# EAGLE design LogicSniffer-v1rev4-batchpcb (EAGLE 5.06)
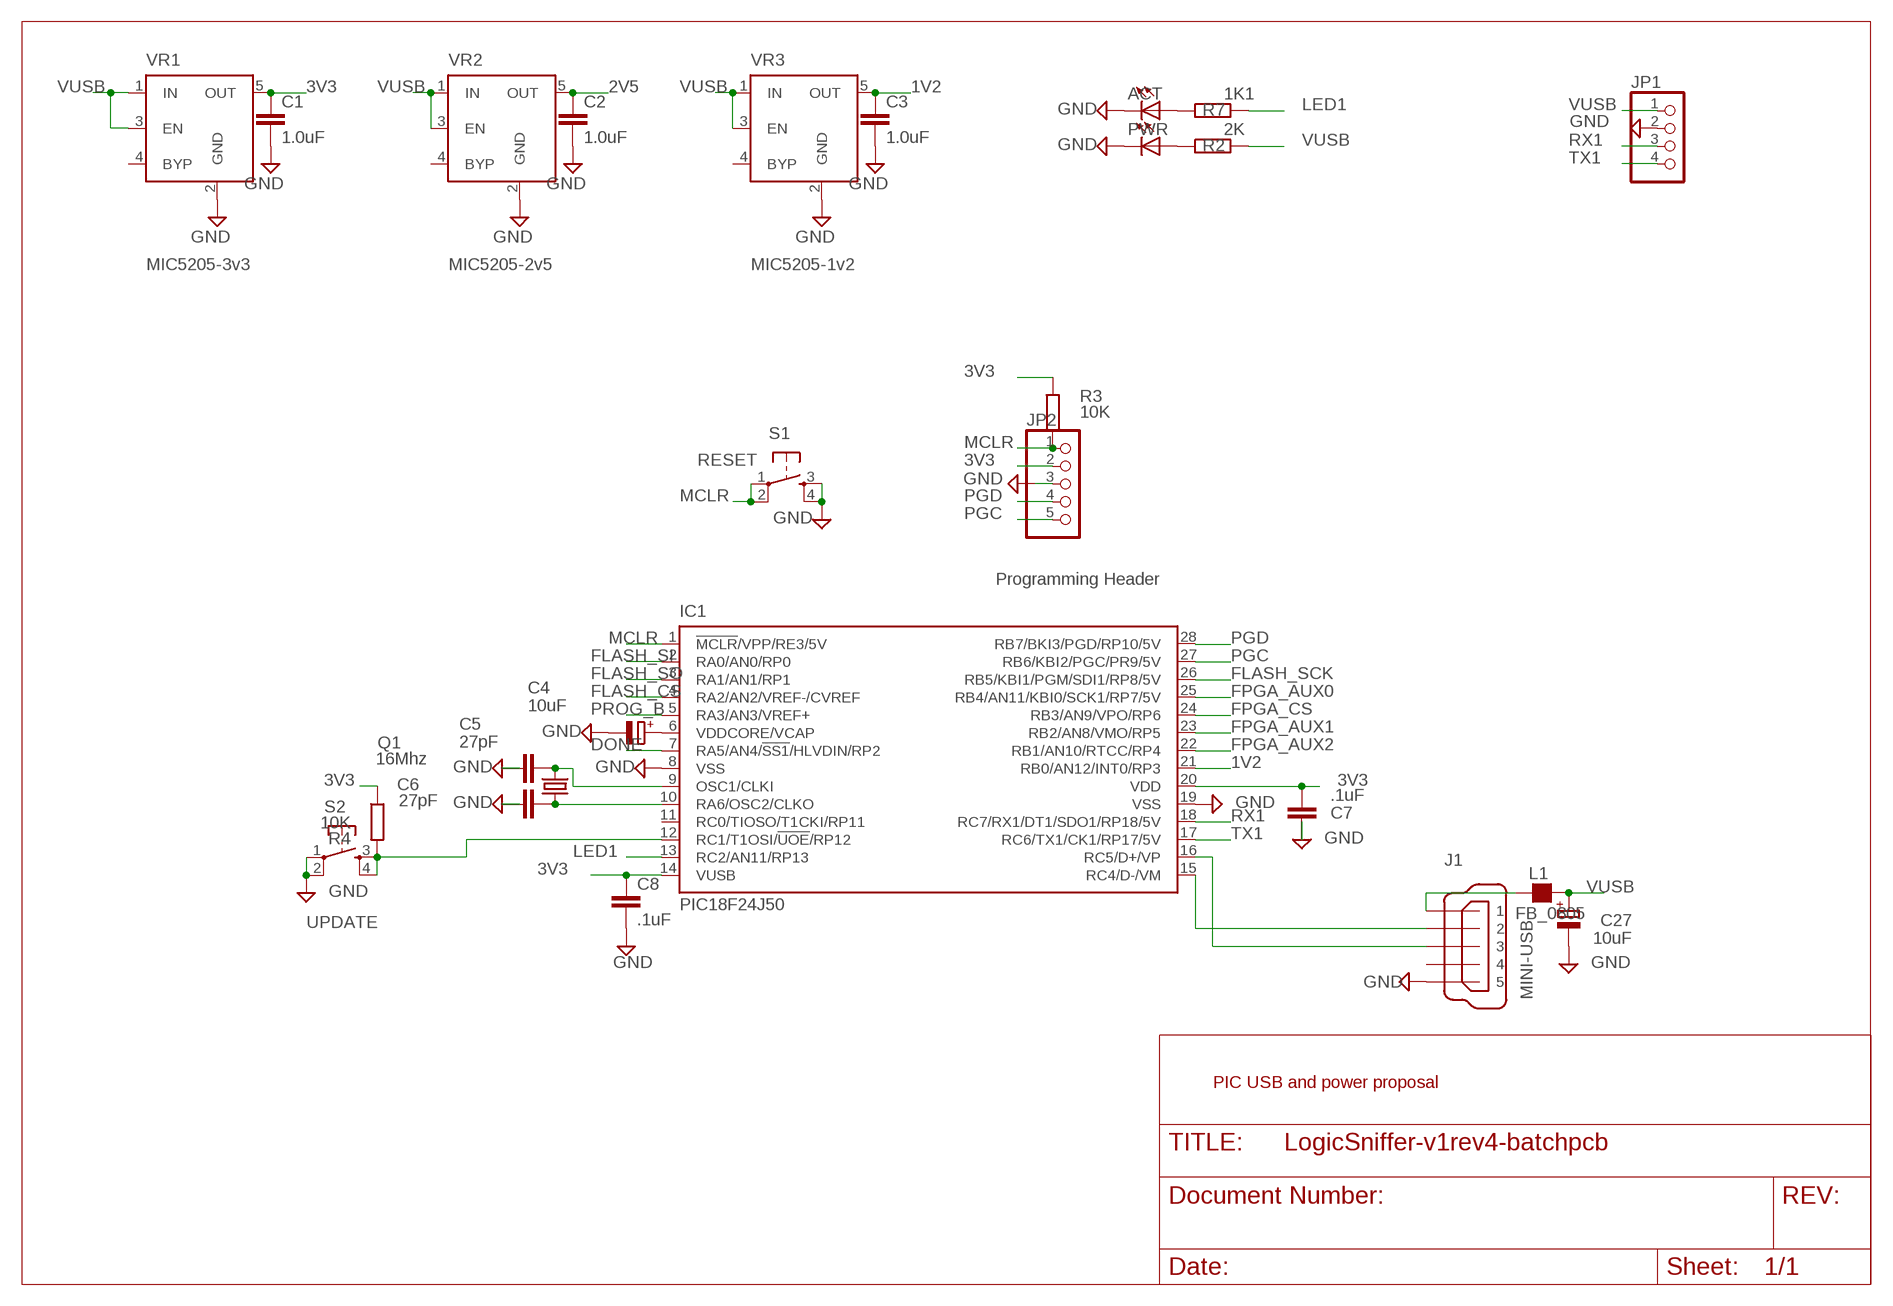
[diagram p0: schematic, sheet 1, part 1 of 2]
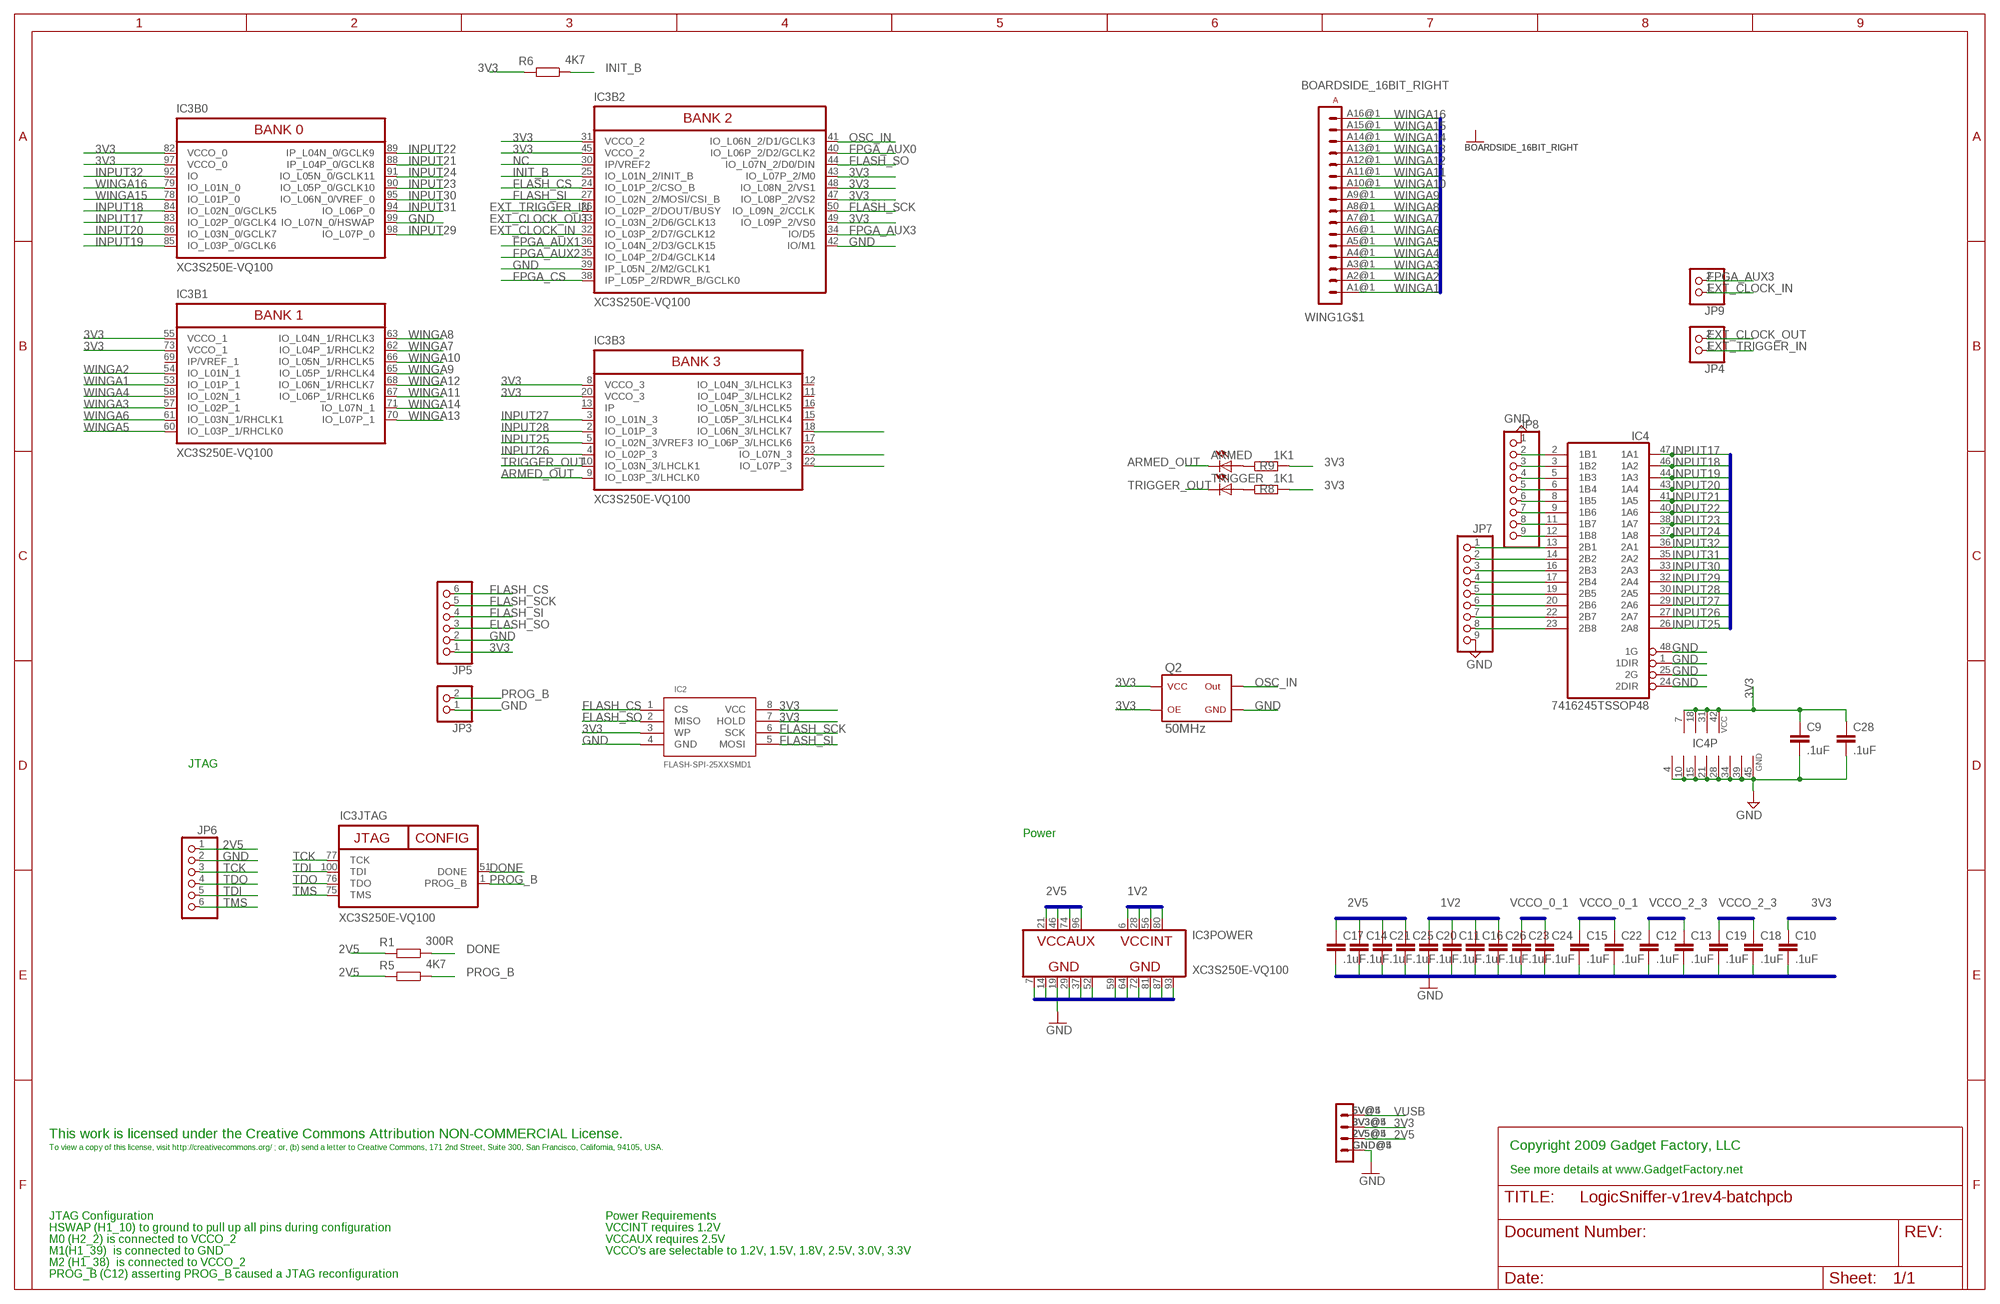
[diagram p1: schematic, sheet 1, part 2 of 2]

## Parts
ACT  LEDCHIP-LED0805  [CHIP-LED0805]
ARMED  LEDCHIP-LED0805  [CHIP-LED0805]
C1  1.0uF  C-EUC0805  [C0805]
C2  1.0uF  C-EUC0805  [C0805]
C3  1.0uF  C-EUC0805  [C0805]
C4  10uF  CPOL-EUSMCA  [SMC_A]
C5  27pF  C-EUC0805  [C0805]
C6  27pF  C-EUC0805  [C0805]
C7  .1uF  C-EUC0603  [C0603]
C8  .1uF  C-EUC0603  [C0603]
C9  .1uF  C-EUC0603K  [C0603K]
C10  .1uF  C-EUC0603K  [C0603K]
C11  .1uF  C-EUC0603K  [C0603K]
C12  .1uF  C-EUC0603K  [C0603K]
C13  .1uF  C-EUC0603K  [C0603K]
C14  .1uF  C-EUC0603K  [C0603K]
C15  .1uF  C-EUC0603K  [C0603K]
C16  .1uF  C-EUC0603K  [C0603K]
C17  .1uF  C-EUC0603K  [C0603K]
C18  .1uF  C-EUC0603K  [C0603K]
C19  .1uF  C-EUC0603K  [C0603K]
C20  .1uF  C-EUC0603K  [C0603K]
C21  .1uF  C-EUC0603K  [C0603K]
C22  .1uF  C-EUC0603K  [C0603K]
C23  .1uF  C-EUC0603K  [C0603K]
C24  .1uF  C-EUC0603K  [C0603K]
C25  .1uF  C-EUC0603K  [C0603K]
C26  .1uF  C-EUC0603  [C0603]
C27  10uF  CPOL-EUSMCA  [SMC_A]
C28  .1uF  C-EUC0603K  [C0603K]
IC1  PIC18F24J50  MICROCHIPSSOP  [SSOP28]
IC2  FLASH-SPI-25XXSMD1  [SO08-EIAJ]
IC3  XC3S250E-VQ100  [VQ100]
IC4  7416245TSSOP48  [TSSOP48]
J1  MINI-USB  MINI-USB-32005-201  [32005-201]
JP1  PINHD-1X4  [1X04]
JP2  PINHD-1X5  [1X05]
JP3  PINHD-1X2  [1X02]
JP4  PINHD-1X2  [1X02]
JP5  PINHD-1X6  [1X06]
JP6  PINHD-1X6  [1X06]
JP7  PINHD-1X9  [1X09]
JP8  PINHD-1X9  [1X09]
JP9  PINHD-1X2  [1X02]
L1  FB_0805  [L0805]
PWR  LEDCHIP-LED0805  [CHIP-LED0805]
Q1  16Mhz  CRYSTALHC49UP  [HC49UP]
Q2  50MHz  OSC1  [OSC1]
R1  300R  R-EU_R0805  [R0805]
R2  2K  R-EU_M0805  [M0805]
R3  10K  R-EU_R0805  [R0805]
R4  10K  R-EU_R0805  [R0805]
R5  4K7  R-EU_R0805  [R0805]
R6  4K7  R-EU_R0805  [R0805]
R7  1K1  R-EU_M0805  [M0805]
R8  1K1  R-EU_M0805  [M0805]
R9  1K1  R-EU_M0805  [M0805]
S1  RESET  TAC_SWITCHSND  [TACTILE_SWITCH_SMD]
S2  UPDATE  TAC_SWITCHSND  [TACTILE_SWITCH_SMD]
TRIGGER  LEDCHIP-LED0805  [CHIP-LED0805]
VR1  MIC5205-3v3  MIC5219XX  [SOT23-5]
VR2  MIC5205-2v5  MIC5219XX  [SOT23-5]
VR3  MIC5205-1v2  MIC5219XX  [SOT23-5]
WING1  BOARDSIDE_16BIT_RIGHT  [BOARDSIDE_16BIT_RIGHT]

## Nets
1V2: C3.1 C11.1 C16.1 C20.1 C26.1 IC1.21(RB0/AN12/INT0/RP3) IC3.6(POWER:VCCINT) IC3.28(POWER:VCCINT) IC3.56(POWER:VCCINT) IC3.80(POWER:VCCINT) VR3.5(OUT)
2V5: C2.1 C14.1 C17.1 C21.1 C25.1 IC3.21(POWER:VCCAUX) IC3.46(POWER:VCCAUX) IC3.74(POWER:VCCAUX) IC3.96(POWER:VCCAUX) JP6.1 R1.2 R5.2 VR2.5(OUT) WING1.2V5@4(2V5) WING1.2V5@5(2V5)
3V3: C1.1 C7.1 C8.1 C9.1 C10.1 C12.1 C13.1 C15.1 C18.1 C19.1 C22.1 C23.1 C24.1 C28.1 IC1.14(VUSB) IC1.20(VDD) IC2.3(WP) IC2.7(HOLD) IC2.8(VCC) IC3.8(B3:VCCO_3) IC3.20(B3:VCCO_3) IC3.31(B2:VCCO_2) IC3.43(B2:IO_L07P_2/M0) IC3.45(B2:VCCO_2) IC3.47(B2:IO_L08P_2/VS2) IC3.48(B2:IO_L08N_2/VS1) IC3.49(B2:IO_L09P_2/VS0) IC3.55(B1:VCCO_1) IC3.73(B1:VCCO_1) IC3.82(B0:VCCO_0) IC3.97(B0:VCCO_0) IC4.7(VCC) IC4.18(VCC) IC4.31(VCC) IC4.42(VCC) JP2.2 JP5.1 Q2.1@1(OE) Q2.4@4(VCC) R3.2 R4.1 R6.2 R8.2 R9.2 VR1.5(OUT) WING1.3V3@4(3V3) WING1.3V3@5(3V3)
$N23: J1.1 L1.1
ARMED_OUT: ARMED.C IC3.9(B3:IO_L03P_3/LHCLK0)
DONE: IC1.7(RA5/AN4/!SS1!/HLVDIN/RP2) IC3.51(JTAG:DONE) R1.1
EXT_CLOCK_IN: IC3.32(B2:IO_L03P_2/D7/GCLK12) JP9.1
EXT_CLOCK_OUT: IC3.33(B2:IO_L03N_2/D6/GCLK13) JP4.2
EXT_TRIGGER_IN: IC3.26(B2:IO_L02P_2/DOUT/BUSY) JP4.1
FLASH_CS: IC1.4(RA2/AN2/VREF-/CVREF) IC2.1(CS) IC3.24(B2:IO_L01P_2/CSO_B) JP5.6
FLASH_SCK: IC1.26(RB5/KBI1/PGM/SDI1/RP8/5V) IC2.6(SCK) IC3.50(B2:IO_L09N_2/CCLK) JP5.5
FLASH_SI: IC1.2(RA0/AN0/RP0) IC2.5(MOSI) IC3.27(B2:IO_L02N_2/MOSI/CSI_B) JP5.4
FLASH_SO: IC1.3(RA1/AN1/RP1) IC2.2(MISO) IC3.44(B2:IO_L07N_2/D0/DIN) JP5.3
FPGA_AUX0: IC1.25(RB4/AN11/KBI0/SCK1/RP7/5V) IC3.40(B2:IO_L06P_2/D2/GCLK2)
FPGA_AUX1: IC1.23(RB2/AN8/VMO/RP5) IC3.36(B2:IO_L04N_2/D3/GCLK15)
FPGA_AUX2: IC1.22(RB1/AN10/RTCC/RP4) IC3.35(B2:IO_L04P_2/D4/GCLK14)
FPGA_AUX3: IC3.34(B2:IO/D5) JP9.2
FPGA_CS: IC1.24(RB3/AN9/VPO/RP6) IC3.38(B2:IP_L05P_2/RDWR_B/GCLK0)
GND: ACT.C C1.2 C2.2 C3.2 C4.- C5.2 C6.2 C7.2 C8.2 C9.2 C10.2 C11.2 C12.2 C13.2 C14.2 C15.2 C16.2 C17.2 C18.2 C19.2 C20.2 C21.2 C22.2 C23.2 C24.2 C25.2 C26.2 C27.- C28.2 IC1.8(VSS) IC1.19(VSS) IC2.4(GND) IC3.7(POWER:GND) IC3.14(POWER:GND) IC3.19(POWER:GND) IC3.29(POWER:GND) IC3.37(POWER:GND) IC3.39(B2:IP_L05N_2/M2/GCLK1) IC3.42(B2:IO/M1) IC3.52(POWER:GND) IC3.59(POWER:GND) IC3.64(POWER:GND) IC3.72(POWER:GND) IC3.81(POWER:GND) IC3.87(POWER:GND) IC3.93(POWER:GND) IC3.99(B0:IO_L07N_0/HSWAP) IC4.1(1DIR) IC4.4(GND) IC4.10(GND) IC4.15(GND) IC4.21(GND) IC4.24(2DIR) IC4.25(2G) IC4.28(GND) IC4.34(GND) IC4.39(GND) IC4.45(GND) IC4.48(1G) J1.5 JP1.2 JP2.3 JP3.1 JP5.2 JP6.2 JP7.9 JP8.1 PWR.C Q2.2@2(GND) S1.3 S1.4 S2.1 S2.2 VR1.2(GND) VR2.2(GND) VR3.2(GND) WING1.GND@1(GND) WING1.GND@2(GND) WING1.GND@4(GND) WING1.GND@5(GND)
INIT_B: IC3.25(B2:IO_L01N_2/INIT_B) R6.1
INPUT17: IC3.83(B0:IO_L02P_0/GCLK4) IC4.47(1A1)
INPUT18: IC3.84(B0:IO_L02N_0/GCLK5) IC4.46(1A2)
INPUT19: IC3.85(B0:IO_L03P_0/GCLK6) IC4.44(1A3)
INPUT20: IC3.86(B0:IO_L03N_0/GCLK7) IC4.43(1A4)
INPUT21: IC3.88(B0:IP_L04P_0/GCLK8) IC4.41(1A5)
INPUT22: IC3.89(B0:IP_L04N_0/GCLK9) IC4.40(1A6)
INPUT23: IC3.90(B0:IO_L05P_0/GCLK10) IC4.38(1A7)
INPUT24: IC3.91(B0:IO_L05N_0/GCLK11) IC4.37(1A8)
INPUT25: IC3.5(B3:IO_L02N_3/VREF3) IC4.26(2A8)
INPUT26: IC3.4(B3:IO_L02P_3) IC4.27(2A7)
INPUT27: IC3.3(B3:IO_L01N_3) IC4.29(2A6)
INPUT28: IC3.2(B3:IO_L01P_3) IC4.30(2A5)
INPUT29: IC3.98(B0:IO_L07P_0) IC4.32(2A4)
INPUT30: IC3.95(B0:IO_L06N_0/VREF_0) IC4.33(2A3)
INPUT31: IC3.94(B0:IO_L06P_0) IC4.35(2A2)
INPUT32: IC3.92(B0:IO) IC4.36(2A1)
LED1: IC1.13(RC2/AN11/RP13) R7.2
MCLR: IC1.1(!MCLR!/VPP/RE3/5V) JP2.1 R3.1 S1.1 S1.2
N$1: C5.1 IC1.9(OSC1/CLKI) Q1.2
N$2: C6.1 IC1.10(RA6/OSC2/CLKO) Q1.1
N$3: IC1.12(RC1/T1OSI/!UOE!/RP12) R4.2 S2.3 S2.4
N$4: C4.+ IC1.6(VDDCORE/VCAP)
N$5: PWR.A R2.1
N$6: ARMED.A R9.1
N$7: ACT.A R7.1
N$8: R8.1 TRIGGER.A
N$9: IC3.22(B3:IO_L07P_3)
N$10: IC3.23(B3:IO_L07N_3)
N$11: IC4.12(1B8) JP8.9
N$12: IC4.11(1B7) JP8.8
N$13: IC4.9(1B6) JP8.7
N$14: IC4.8(1B5) JP8.6
N$15: IC4.6(1B4) JP8.5
N$16: IC4.5(1B3) JP8.4
N$17: IC4.3(1B2) JP8.3
N$18: IC4.2(1B1) JP8.2
N$19: IC4.13(2B1) JP7.1
N$20: IC4.14(2B2) JP7.2
N$21: IC3.18(B3:IO_L06N_3/LHCLK7)
N$22: IC4.16(2B3) JP7.3
N$23: IC4.17(2B4) JP7.4
N$24: IC4.19(2B5) JP7.5
N$25: IC4.20(2B6) JP7.6
N$26: IC4.22(2B7) JP7.7
N$27: IC4.23(2B8) JP7.8
NC: IC3.30(B2:IP/VREF2)
OSC_IN: IC3.41(B2:IO_L06N_2/D1/GCLK3) Q2.3@3(OUT)
PGC: IC1.27(RB6/KBI2/PGC/PR9/5V) JP2.5
PGD: IC1.28(RB7/BKI3/PGD/RP10/5V) JP2.4
PROG_B: IC1.5(RA3/AN3/VREF+) IC3.1(JTAG:PROG_B) JP3.2 R5.1
RC4: IC1.15(RC4/D-/VM) J1.2
RC5: IC1.16(RC5/D+/VP) J1.3
RX1: IC1.18(RC7/RX1/DT1/SDO1/RP18/5V) JP1.3
TCK: IC3.77(JTAG:TCK) JP6.3
TDI: IC3.100(JTAG:TDI) JP6.5
TDO: IC3.76(JTAG:TDO) JP6.4
TMS: IC3.75(JTAG:TMS) JP6.6
TRIGGER_OUT: IC3.10(B3:IO_L03N_3/LHCLK1) TRIGGER.C
TX1: IC1.17(RC6/TX1/CK1/RP17/5V) JP1.4
VUSB: C27.+ JP1.1 L1.2 R2.2 VR1.1(IN) VR1.3(EN) VR2.1(IN) VR2.3(EN) VR3.1(IN) VR3.3(EN) WING1.5V@4(5V) WING1.5V@5(5V)
WINGA1: IC3.53(B1:IO_L01P_1) WING1.A1@1(A1)
WINGA2: IC3.54(B1:IO_L01N_1) WING1.A2@1(A2)
WINGA3: IC3.57(B1:IO_L02P_1) WING1.A3@1(A3)
WINGA4: IC3.58(B1:IO_L02N_1) WING1.A4@1(A4)
WINGA5: IC3.60(B1:IO_L03P_1/RHCLK0) WING1.A5@1(A5)
WINGA6: IC3.61(B1:IO_L03N_1/RHCLK1) WING1.A6@1(A6)
WINGA7: IC3.62(B1:IO_L04P_1/RHCLK2) WING1.A7@1(A7)
WINGA8: IC3.63(B1:IO_L04N_1/RHCLK3) WING1.A8@1(A8)
WINGA9: IC3.65(B1:IO_L05P_1/RHCLK4) WING1.A9@1(A9)
WINGA10: IC3.66(B1:IO_L05N_1/RHCLK5) WING1.A10@1(A10)
WINGA11: IC3.67(B1:IO_L06P_1/RHCLK6) WING1.A11@1(A11)
WINGA12: IC3.68(B1:IO_L06N_1/RHCLK7) WING1.A12@1(A12)
WINGA13: IC3.70(B1:IO_L07P_1) WING1.A13@1(A13)
WINGA14: IC3.71(B1:IO_L07N_1) WING1.A14@1(A14)
WINGA15: IC3.78(B0:IO_L01P_0) WING1.A15@1(A15)
WINGA16: IC3.79(B0:IO_L01N_0) WING1.A16@1(A16)
Unconnected: IC1.11(RC0/TIOSO/T1CKI/RP11) IC3.11(B3:IO_L04P_3/LHCLK2) IC3.12(B3:IO_L04N_3/LHCLK3) IC3.13(B3:IP) IC3.15(B3:IO_L05P_3/LHCLK4) IC3.16(B3:IO_L05N_3/LHCLK5) IC3.17(B3:IO_L06P_3/LHCLK6) IC3.69(B1:IP/VREF_1) J1.4 VR1.4(BYP) VR2.4(BYP) VR3.4(BYP)

## Buses
GND
2V5
1V2
VCCO_0_1
VCCO_2_3
3V3
WINGA[1..16]
INPUT[17..32]

## Notes on the sheet
- RESET
- Programming Header
- JTAG
- UPDATE
- Power
- PIC USB and power proposal
- This work is licensed under the Creative Commons Attribution NON-COMMERCIAL License.
- To view a copy of this license, visit http://creativecommons.org/ ; or, (b) send a letter to Creative Commons, 171 2nd Street, Suite 300, San Francisco, California, 94105, USA. | Copyright 2009 Gadget Factory, LLC
- See more details at www.GadgetFactory.net
- JTAG Configuration | Power Requirements
- HSWAP (H1_10) to ground to pull up all pins during configuration | VCCINT requires 1.2V
- M0 (H2_2) is connected to VCCO_2 | VCCAUX requires 2.5V
- M1(H1_39)  is connected to GND | VCCO's are selectable to 1.2V, 1.5V, 1.8V, 2.5V, 3.0V, 3.3V
- M2 (H1_38)  is connected to VCCO_2
- PROG_B (C12) asserting PROG_B caused a JTAG reconfiguration

## Library data of the parts
ACT ARMED PWR TRIGGER = led:LED: LED OSRAM: - CHIPLED LG R971, LG N971, LY N971, LG Q971, LY Q971, LO R971, LY R971 LH N974, LH R974 LS Q976, LO Q976, LY Q976 LO Q996 - Hyper CHIPLED LW Q18S LB Q993, LB Q99A, LB R99A - SideLED LS A670, LO A670, LY A670, LG A670, LP A670 LB A673, LV A673, LT A673, LW A673 LH A674 LY A675 LS A676, LA A676, LO A676, LY A676, LW A676 LS A679, LY A679, LG A679 - Hyper Micro SIDELED® LS Y876, LA Y876, LO Y876, LY Y876 LT Y87S - SmartLED LW L88C, LW L88S LB L89C, LB L89S, LG L890 LS L89K, LO L89K, LY L89K LS L896, LA L896, LO L896, LY L896 - TOPLED LS T670, LO T670, LY T670, LG T670, LP T670 LSG T670, LSP T670, LSY T670, LOP T670, LYG T670 LG T671, LOG T671, LSG T671 LB T673, LV T673, LT T673, LW T673 LH T674 LS T676, LA T676, LO T676, LY T676, LB T676, LH T676, LSB T676, LW T676 LB T67C, LV T67C, LT T67C, LS T67K, LO T67K, LY T67K, LW E67C LS E67B, LA E67B, LO E67B, LY E67B, LB E67C, LV E67C, LT E67C LW T67C LS T679, LY T679, LG T679 LS T770, LO T770, LY T770, LG T770, LP T770 LB T773, LV T773, LT T773, LW T773 LH T774 LS E675, LA E675, LY E675, LS T675 LS T776, LA T776, LO T776, LY T776, LB T776 LHGB T686 LT T68C, LB T68C - Hyper Mini TOPLED® LB M676 - Mini TOPLED Santana® LG M470 LS M47K, LO M47K, LY M47K Source: http://www.osram.convergy.de - LUMILED® LXK2-PW12-R00, LXK2-PW12-S00, LXK2-PW14-U00, LXK2-PW14-V00 LXK2-PM12-R00, LXK2-PM12-S00, LXK2-PM14-U00 LXK2-PE12-Q00, LXK2-PE12-R00, LXK2-PE12-S00, LXK2-PE14-T00, LXK2-PE14-U00 LXK2-PB12-K00, LXK2-PB12-L00, LXK2-PB12-M00, LXK2-PB14-N00, LXK2-PB14-P00, LXK2-PB14-Q00 LXK2-PR12-L00, LXK2-PR12-M00, LXK2-PR14-Q00, LXK2-PR14-R00 LXK2-PD12-Q00, LXK2-PD12-R00, LXK2-PD12-S00 LXK2-PH12-R00, LXK2-PH12-S00 LXK2-PL12-P00, LXK2-PL12-Q00, LXK2-PL12-R00 Source: www.luxeon.com
C1-C3 C5-C26 C28 = rcl:C-EU: CAPACITOR, European symbol
C4 C27 = rcl:CPOL-EU: POLARIZED CAPACITOR, European symbol
IC1 = library3:MICROCHIP
IC2 = GadgetFactory:FLASH-SPI-25XX: SPI Flash
IC3 = xilinx-xc3sxxxe_vq100:XC3S250E: Xilinx Spartan 3E FPGA
IC4 = dp_devices:74*16245: 16-bit BUS TRANSCEIVER, 3-state
J1 = con-cypressindustries:MINI-USB-: MINI USB-B Conector Source: www.cypressindustries.com
JP1 = pinhead-2:PINHD-1X4: PIN HEADER
JP2 = pinhead-2:PINHD-1X5: PIN HEADER
JP3 JP4 JP9 = pinhead-2:PINHD-1X2: PIN HEADER
JP5 JP6 = pinhead-2:PINHD-1X6: PIN HEADER
JP7 JP8 = pinhead-2:PINHD-1X9: PIN HEADER
L1 = rc-master-smd:FB_: FERRITE BEAD
Q1 = crystal:CRYSTAL: CRYSTAL
Q2 = MondoCPLDCore-XC95_Rev1.5:OSC1
R1-R9 = rcl:R-EU_: RESISTOR, European symbol
S1 S2 = SparkFun-3-2-07:TAC_SWITCH: Momentary Switch Button commonly used for reset or general input. Spark Fun Electronics SKU : Comp-PBS
VR1-VR3 = v-reg-micrel:MIC5219XX: VOLTAGE REGULATOR
WING1 = GadgetFactory:BOARDSIDE_16BIT_RIGHT

## Board
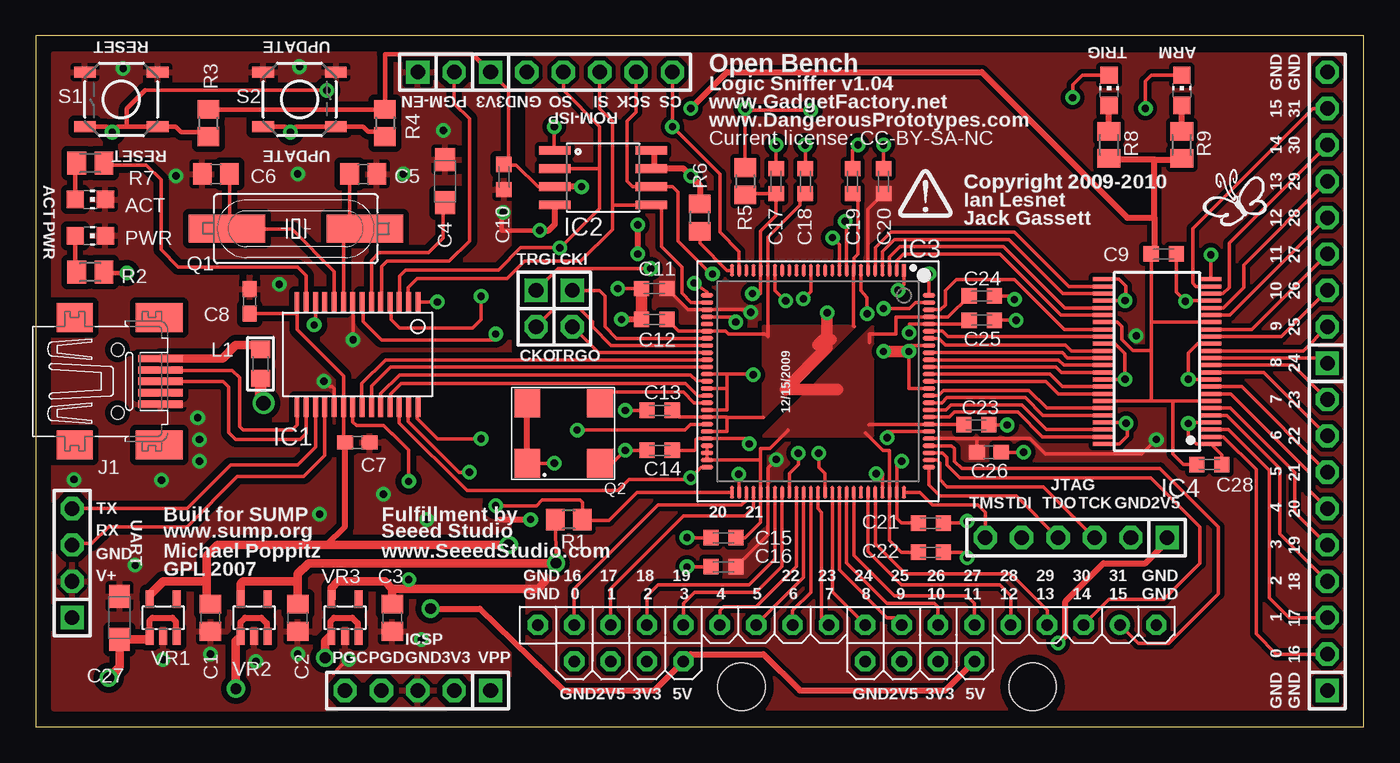
[diagram p2: board, top side]
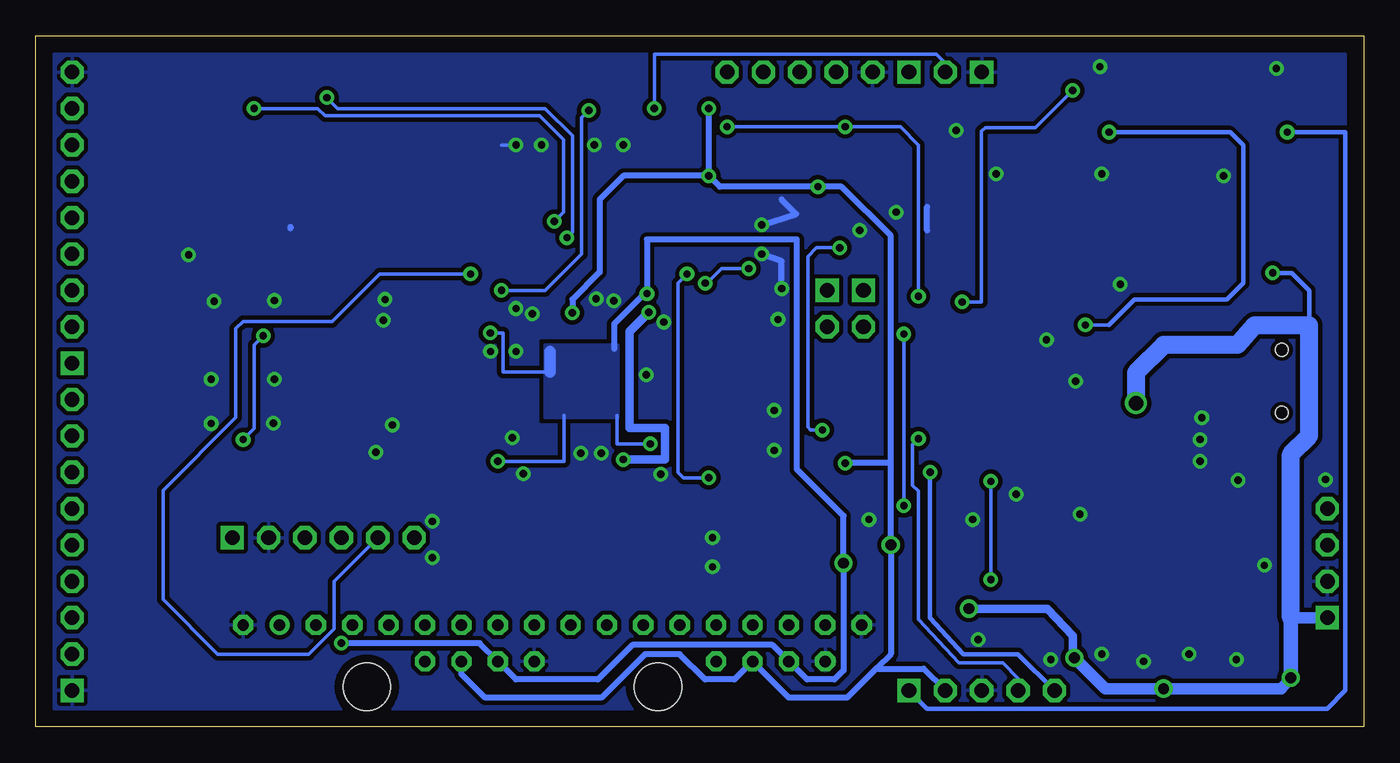
[diagram p3: board, bottom side, seen from below]

Size 92.71 x 48.26 mm. Coordinates in mm from the lower left corner, seen from the top.
Outline: 0,48.26 0,0 92.71,0 92.71,48.26 0,48.26
Copper layers (1*16): Top 0.035mm / dielectric 1.5mm / Bottom 0.035mm
Design rules "SparkFun": minimum track width 8mil, minimum drill 20mil, track to track 8mil, track to pad 8mil, pad to pad 8mil, via to via 8mil, smd to smd 8mil, copper to edge 10mil, drill to drill 8mil, minimum pad ring 12mil, minimum via ring 10mil, stop-mask expansion 4mil, vias tented up to drill 25mil, thermal gap 10mil

### Footprints (pad centres in the part's own frame; a part is rotated, then mirrored left to right if it is on the bottom)
CHIP-LED0805 = smd 1.2 x 1.2: A 0,-1.05; C 0,1.05
C0805 = smd 1.3 x 1.5: 1 -0.95,0; 2 0.95,0
SMC_A = smd 1.6 x 1.4: + -1.5,0; - 1.5,0
C0603 = smd 1.1 x 1: 1 -0.85,0; 2 0.85,0
C0603K = smd 1.05 x 1.08: 1 -0.875,0; 2 0.875,0
SSOP28 = smd 0.348 x 1.397: 1 -4.225,-3.656; 2 -3.575,-3.656; 3 -2.925,-3.656; 4 -2.275,-3.656; 5 -1.625,-3.656; 6 -0.975,-3.656; 7 -0.325,-3.656; 8 0.325,-3.656; 9 0.975,-3.656; 10 1.625,-3.656; 11 2.275,-3.656; 12 2.925,-3.656; 13 3.575,-3.656; 14 4.225,-3.656; 15 4.225,3.656; 16 3.575,3.656; 17 2.925,3.656; 18 2.275,3.656; 19 1.625,3.656; 20 0.975,3.656; 21 0.325,3.656; 22 -0.325,3.656; 23 -0.975,3.656; 24 -1.625,3.656; 25 -2.275,3.656; 26 -2.925,3.656; 27 -3.575,3.656; 28 -4.225,3.656
SO08-EIAJ = smd 0.61 x 2.21: 1 -1.905,-3.378; 2 -0.635,-3.378; 3 0.635,-3.378; 4 1.905,-3.378; 5 1.905,3.353; 6 0.635,3.353; 7 -0.635,3.353; 8 -1.905,3.353
VQ100 = smd 0.85 x 0.28: 1 -7.75,6; 2 -7.75,5.5; 3 -7.75,5; 4 -7.75,4.5; 5 -7.75,4; 6 -7.75,3.5; 7 -7.75,3; 8 -7.75,2.5; 9 -7.75,2; 10 -7.75,1.5; 11 -7.75,1; 12 -7.75,0.5; 13 -7.75,0; 14 -7.75,-0.5; 15 -7.75,-1; 16 -7.75,-1.5; 17 -7.75,-2; 18 -7.75,-2.5; 19 -7.75,-3; 20 -7.75,-3.5; 21 -7.75,-4; 22 -7.75,-4.5; 23 -7.75,-5; 24 -7.75,-5.5; 25 -7.75,-6; 51 7.75,-6; 52 7.75,-5.5; 53 7.75,-5; 54 7.75,-4.5; 55 7.75,-4; 56 7.75,-3.5; 57 7.75,-3; 58 7.75,-2.5; 59 7.75,-2; 60 7.75,-1.5; 61 7.75,-1; 62 7.75,-0.5; 63 7.75,0; 64 7.75,0.5; 65 7.75,1; 66 7.75,1.5; 67 7.75,2; 68 7.75,2.5; 69 7.75,3; 70 7.75,3.5; 71 7.75,4; 72 7.75,4.5; 73 7.75,5; 74 7.75,5.5; 75 7.75,6 | smd 0.28 x 0.85: 26 -6,-7.75; 27 -5.5,-7.75; 28 -5,-7.75; 29 -4.5,-7.75; 30 -4,-7.75; 31 -3.5,-7.75; 32 -3,-7.75; 33 -2.5,-7.75; 34 -2,-7.75; 35 -1.5,-7.75; 36 -1,-7.75; 37 -0.5,-7.75; 38 0,-7.75; 39 0.5,-7.75; 40 1,-7.75; 41 1.5,-7.75; 42 2,-7.75; 43 2.5,-7.75; 44 3,-7.75; 45 3.5,-7.75; 46 4,-7.75; 47 4.5,-7.75; 48 5,-7.75; 49 5.5,-7.75; 50 6,-7.75; 76 6,7.75; 77 5.5,7.75; 78 5,7.75; 79 4.5,7.75; 80 4,7.75; 81 3.5,7.75; 82 3,7.75; 83 2.5,7.75; 84 2,7.75; 85 1.5,7.75; 86 1,7.75; 87 0.5,7.75; 88 0,7.75; 89 -0.5,7.75; 90 -1,7.75; 91 -1.5,7.75; 92 -2,7.75; 93 -2.5,7.75; 94 -3,7.75; 95 -3.5,7.75; 96 -4,7.75; 97 -4.5,7.75; 98 -5,7.75; 99 -5.5,7.75; 100 -6,7.75
TSSOP48 = smd 0.28 x 1.43: 1 -5.49,-3.794; 2 -4.99,-3.794; 3 -4.49,-3.794; 4 -3.99,-3.794; 5 -3.49,-3.794; 6 -2.99,-3.794; 7 -2.49,-3.794; 8 -1.99,-3.794; 9 -1.49,-3.794; 10 -0.99,-3.794; 11 -0.49,-3.794; 12 0.01,-3.794; 13 0.51,-3.794; 14 1.01,-3.794; 15 1.51,-3.794; 16 2.01,-3.794; 17 2.51,-3.794; 18 3.01,-3.794; 19 3.51,-3.794; 20 4.01,-3.794; 21 4.51,-3.794; 22 5.01,-3.794; 23 5.51,-3.794; 24 6.01,-3.794; 25 6.01,3.756; 26 5.51,3.756; 27 5.01,3.756; 28 4.51,3.756; 29 4.01,3.756; 30 3.51,3.756; 31 3.01,3.756; 32 2.51,3.756; 33 2.01,3.756; 34 1.51,3.756; 35 1.01,3.756; 36 0.51,3.756; 37 0.01,3.756; 38 -0.49,3.756; 39 -0.99,3.756; 40 -1.49,3.756; 41 -1.99,3.756; 42 -2.49,3.756; 43 -2.99,3.756; 44 -3.49,3.756; 45 -3.99,3.756; 46 -4.49,3.756; 47 -4.99,3.756; 48 -5.49,3.756
32005-201 = smd 3.1 x 0.5: 1 3,1.6; 2 3,0.8; 3 3,0; 4 3,-0.8; 5 3,-1.6 | smd 2.5 x 2: M1 -3,-4.45; M2 -3,4.45 | smd 3.3 x 2: M3 2.9,4.45; M4 2.9,-4.45 | hole 0.9: 0,2.2; 0,-2.2
1X04 = drill 1.016 square: 1 -3.81,0 | drill 1.016 octagon: 2 -1.27,0; 3 1.27,0; 4 3.81,0
1X05 = drill 1.016 square: 1 -5.08,0 | drill 1.016 octagon: 2 -2.54,0; 3 0,0; 4 2.54,0; 5 5.08,0
1X02 = drill 1.016 square: 1 -1.27,0 | drill 1.016 octagon: 2 1.27,0
1X06 = drill 1.016 square: 1 -6.35,0 | drill 1.016 octagon: 2 -3.81,0; 3 -1.27,0; 4 1.27,0; 5 3.81,0; 6 6.35,0
1X09 = drill 1.016 square: 1 -10.16,0 | drill 1.016 octagon: 2 -7.62,0; 3 -5.08,0; 4 -2.54,0; 5 0,0; 6 2.54,0; 7 5.08,0; 8 7.62,0; 9 10.16,0
L0805 = smd 1.2 x 1.3: 1 -1.016,0; 2 1.016,0
HC49UP = smd 5.334 x 1.93: 1 -4.826,0; 2 4.826,0
OSC1 = smd 1.8 x 2: 1@1 0,0; 2@2 5.08,0; 3@3 5.08,4.2; 4@4 0,4.2
R0805 = smd 1.3 x 1.5: 1 -0.95,0; 2 0.95,0
M0805 = smd 1.3 x 1.6: 1 -0.95,0; 2 0.95,0
TACTILE_SWITCH_SMD = smd 1.524 x 0.762: 1 -2.54,1.905; 2 2.54,1.905; 3 -2.54,-1.905; 4 2.54,-1.905
SOT23-5 = smd 0.55 x 1.2: 1 -0.95,-1.3; 2 0,-1.3; 3 0.95,-1.3; 4 0.95,1.3; 5 -0.95,1.3
BOARDSIDE_16BIT_RIGHT = drill 0.8 octagon: 2V5@4 3.81,-16.51; 2V5@5 3.81,3.81; 3V3@4 3.81,-13.97; 3V3@5 3.81,6.35; 5V@4 3.81,-11.43; 5V@5 3.81,8.89; A1@1 1.27,-19.05; A2@1 1.27,-16.51; A3@1 1.27,-13.97; A4@1 1.27,-11.43; A5@1 1.27,-8.89; A6@1 1.27,-6.35; A7@1 1.27,-3.81; A8@1 1.27,-1.27; A9@1 1.27,1.27; A10@1 1.27,3.81; A11@1 1.27,6.35; A12@1 1.27,8.89; A13@1 1.27,11.43; A14@1 1.27,13.97; A15@1 1.27,16.51; GND@1 1.27,-21.59; GND@2 1.27,21.59; GND@4 3.81,-19.05; GND@5 3.81,1.27 | drill 0.8 round: A16@1 1.27,19.05 | hole 3.302: 5.588,12.954; 5.588,-7.366

### Placement (x,y rotation side)
ACT  3.81,36.83 270 top
ARMED  80.01,44.45 0 top
C1  12.19,7.62 270 top
C2  18.29,7.62 270 top
C3  24.89,7.62 270 top
C4  28.57,38.1 90 top
C5  22.86,38.61 0 top
C6  12.57,38.61 180 top
C7  22.45,19.86 0 top
C8  14.94,29.72 90 top
C9  78.74,33.02 0 top
C10  32.69,38.4 270 top
C11  43.18,30.61 180 top
C12  43.18,28.45 180 top
C13  43.56,22.1 180 top
C14  43.56,19.3 180 top
C15  48.01,13.21 180 top
C16  48.01,11.18 180 top
C17  51.69,38.1 90 top
C18  53.72,38.1 90 top
C19  57.02,38.1 90 top
C20  59.18,38.1 90 top
C21  62.48,14.22 0 top
C22  62.48,12.19 0 top
C23  65.66,21.08 0 top
C24  66.04,30.1 0 top
C25  66.04,28.4 0 top
C26  66.55,19.18 0 top
C27  5.84,7.62 90 top
C28  81.94,18.31 0 top
IC1  22.45,26.01 180 top
IC2  39.62,38.35 270 top
IC3  54.61,24.13 270 top
IC4  78.26,25.25 90 top
J1  5.71,24.13 0 top
JP1  2.54,11.43 90 top
JP2  26.67,2.54 180 top
JP3  27.94,45.72 0 top
JP4  34.92,29.21 270 top
JP5  38.1,45.72 0 top
JP6  72.64,13.21 180 top
JP7  90.17,35.56 90 top
JP8  90.17,12.7 90 top
JP9  37.47,29.21 270 top
L1  15.7,25.35 270 top
PWR  3.81,34.29 270 top
Q1  18.16,34.8 0 top
Q2  34.32,18.39 0 top
R1  37.21,14.48 180 top
R2  3.81,31.75 0 top
R3  12.06,42.16 90 top
R4  24.38,42.16 270 top
R5  49.53,38.1 270 top
R6  46.35,35.56 90 top
R7  3.81,39.37 0 top
R8  74.93,40.64 270 top
R9  80.01,40.64 270 top
S1  5.97,43.81 180 top
S2  18.41,43.81 0 top
TRIGGER  74.93,44.45 0 top
U$1  [DP-LOGO]  60.2,35.56 0 top
U$2  [GADGETFACTORY_LOGO]  81.28,34.42 0 top
VR1  8.89,7.62 0 top
VR2  15.24,7.62 0 top
VR3  21.59,7.62 0 top
WING1  56.64,8.38 270 top

### Tracks (layer width: path | path; a pad name or v marks a point on that pad's centre or on a via)
1V2  (via drill 0.51)
  Top 0.254: IC3.28 | IC3.80 62.36,20.12 | 78.17,20.13 v78.23,20.07 77.22,19.05 70.48,19.05 69.41,20.13 IC3.80 | IC3.80 65.7,20.13 C26.1 | C16.1 51.11,13.4 IC3.56 51.11,18.09 v51.69,18.67 | IC3.28 45.53,29.13 C11.1 | IC3.28 49.74,29.13 v49.91,28.96 | IC3.6 58.11,36.15 C20.1 | v26.04,17.14 26.04,19.33 24.89,20.47 24.89,20.45 24.29,21.05 22.38,21.05 22.13,21.3 IC1.21
  Top 0.305: v26.04,10.29 26.04,9.78 26.16,9.65
  Top 0.61: VR3.5 20.64,9.72 21.08,10.16 24.38,10.16 24.89,9.65 | 24.89,9.65 C3.1 | 24.89,9.65 26.16,9.65 35.05,9.65 35.56,10.16
  Bottom 0.254: v78.23,20.07 77.47,20.83 77.47,26.67 v76.83,27.3 | v26.04,10.29 v26.04,17.14
  Bottom 0.61: v51.69,18.67 48.77,18.67 48.77,20.88 51.26,20.88 51.26,27.61 v49.91,28.96
  pour Top (isolate 0.305, rank 2, no thermals): 34.29,46.99 34.29,1.27 91.44,1.27 91.44,46.99
2V5  (via drill 0.51, 0.76)
  Top 0.254: v50.04,30.25 50.61,30.25 IC3.21 50.61,34.61 51.69,35.69 C17.1 49.55,37.23 R5.2 49.68,37.1 | v60.45,18.54 60.11,18.54 IC3.74 60.11,14.57 60.45,14.22 C21.1 | v60.98,27.51 60.98,28.13 IC3.96 64.9,28.13 C25.1 | C14.1 45.97,19.3 46.1,19.43 46.1,20.07 46.16,20.13 IC3.46 49.51,20.13 49.81,19.82 v49.81,19.76 | 36.36,11.47 R1.2
  Top 0.406: JP6.1 78.99,12.95 77.47,11.43 74.55,11.43 71.88,8.76 71.88,6.35 v71.37,5.84 | 18.03,10.16 18.29,9.91 | v36.32,11.43 36.36,11.47
  Top 0.61: VR2.5 14.29,9.97 14.48,10.16 18.03,10.16 18.29,10.16 | v36.32,11.43 19.05,11.43 18.29,10.67 18.29,10.16 | 18.29,10.16 C2.1
  Bottom 0.254: v49.81,19.76 52.12,19.76 52.12,21.74 | v60.45,18.54 55.83,18.54 55.83,21.74 | 56.79,24.79 60.07,24.79 60.07,27.51 v60.98,27.51 60.96,27.48 | 50.29,30.18 v50.04,30.25 50.29,30.28
  Bottom 0.406: 52.32,26.42 52.32,28.14 50.29,30.18 | v71.37,5.84 61.72,5.84 WING1.2V5@5 59.18,3.3 53.47,3.3 51.05,5.71 41.27,5.71 WING1.2V5@4 38.86,3.3 36.96,3.3 36.32,3.94 v36.32,11.43 36.32,14.73 39.57,17.98 39.57,34.04 50.04,34.04 v50.04,30.25
  Bottom 0.813: 56.79,24.79 56.79,26.21
  pour Bottom (isolate 0.381): 57.15,26.67 57.15,21.59 52.07,21.59 52.07,26.67
3V3  (via drill 0.51, 0.76)
  Top 0.254: 50.61,18.54 IC3.55 50.61,14.29 49.53,13.21 C15.1 | 50.61,18.54 50.61,19.43 51.26,19.43 52.53,20.7 52.53,20.73 | 57.91,20.52 59.13,19.3 59.61,19.3 IC3.73 59.61,13.03 60.45,12.19 C22.1 | 58.22,26.82 58.22,27.43 60.05,27.43 60.05,28.63 IC3.97 63.7,28.63 C24.1 | IC3.45 48.26,20.63 48.26,21.59 | 55.3,27.89 55.3,27.94 | JP5.1 33.02,44.45 33.02,39.59 32.99,39.59 C10.1 32.73,39.24 33.53,39.24 35.05,37.72 IC2.3 36.32,37.72 | 48.26,21.59 48.22,21.63 IC3.43 44.9,21.63 C13.1 | 50.61,18.54 50.52,18.63 IC3.49 IC3.48 IC3.47 | 48.26,21.59 50.8,21.59 | 77.89,28.31 77.89,26.42 | 77.89,26.42 77.89,22.79 77.92,22.76 | 77.89,28.31 77.95,28.25 77.95,28.26 IC4.18 | Q2.1@1 36.17,18.39 v36.2,18.41 | 58.17,21.08 58.21,21.13 IC3.82 64.74,21.13 C23.1 | 77.89,26.42 77.76,26.29 76.58,26.29 75.82,27.05 75.82,27.94 75.5,28.26 IC4.31 | 77.89,28.31 77.89,32.99 C9.1 78.08,33.23 78.11,33.23 | C19.1 57.4,36.84 57.4,33.02 57.11,32.73 IC3.8 57.1,31.88 57.1,27.99 57.15,27.94 | C18.1 53.34,36.84 53.34,36.45 51.11,34.22 IC3.20 51.1,27.25 50.92,27.43 48.36,27.43 48.16,27.63 IC3.31 44.87,27.63 C12.1 | 21.59,16.6 C7.1 21.48,19.76 IC1.20 21.48,24.5 18.23,27.75 18.23,28.85 | C8.1 14.85,28.87 16.66,28.85 18.23,28.85 | 18.23,28.85 IC1.14 | C28.1 80.11,18.31 79.38,19.05 79.38,22.75 79.37,22.76 | 77.92,22.76 IC4.42 | 79.37,22.76 IC4.7 | 77.92,22.76 79.37,22.76
  Top 0.305: JP5.1 30.48,46.99 24.38,46.99 R4.1 R3.2 | C8.1 14.98,28.91
  Top 0.406: R6.2 46.35,37.85 v45.72,38.48 45.21,38.99 43.18,38.99 43.18,39.19 | 20.32,12.7 21.59,13.97 21.59,19.67 | Q2.1@1 Q2.4@4 | v45.72,43.18 48.26,45.72 66.04,45.72 76.2,35.56 78.11,35.56 | 78.11,35.56 78.11,33.23 | 78.11,35.56 78.11,39.62 | 78.11,39.62 79.94,39.62 R9.2 | 78.11,39.62 75,39.62 R8.2 | IC2.8 43.18,40.26 43.18,39.19 | 43.18,39.19 IC2.7 | v38.1,37.72 36.32,37.72
  Top 0.61: v33.02,12.7 20.32,12.7 12.7,12.7 11.94,11.94 11.94,10.18 11.91,10.16 | VR1.5 7.94,9.21 8.89,10.16 11.91,10.16 | 11.91,10.16 11.91,8.75 C1.1
  Top 0.813: v55.24,28.91 55.24,26.49 52.32,23.57 55.98,23.57 | 55.5,27.05 54.99,27.05 54.61,26.67 | 21.59,19.67 C7.1
  Bottom 0.406: 33.97,4.13 33.02,5.08 v33.02,12.7 33.02,18.29 | WING1.3V3@5 62.99,3.68 61.34,2.03 53.21,2.03 50.16,5.08 47.75,5.08 45.97,3.3 43.94,3.3 WING1.3V3@4 40.13,2.03 36.07,2.03 33.97,4.13 | v45.72,38.48 51.69,38.48 53.34,36.83 53.34,31.75 55.24,29.84 v55.24,28.91 | 33.02,18.29 33.02,34.29 36.45,37.72 v38.1,37.72 44.96,37.72 v45.72,38.48 | v36.2,18.41 33.15,18.41 33.02,18.29 | v45.72,38.48 v45.72,43.18 | JP2.2 30.73,4.06 33.91,4.06 33.97,4.13
  pour Top (isolate 0.305): 58.42,20.32 50.8,20.32 58.42,27.94
  pour Top (isolate 0.305): 50.8,27.94 50.8,21.59 57.15,27.94
$N23
  Top 0.61: J1.1 13.03,25.73 13.97,26.67 15.7,26.67 L1.1
ARMED_OUT  (via drill 0.51)
  Top 0.254: ARMED.C 77.89,45.5 77.47,45.09 v77.47,43.18 | IC3.9 56.61,35.21 v56.52,35.31
  Bottom 0.254: v77.47,43.18 73.03,43.18 72.52,42.67 57.53,42.67 55.88,41.02 55.88,35.94 v56.52,35.31
DONE  (via drill 0.51)
  Top 0.254: IC3.51 41.98,16.38 40.03,14.43 38.21,14.43 R1.1 38.16,15.69 38,15.85 35.36,15.85 34.95,15.44 v32.11,15.44 | IC1.7 22.86,29.58 22.86,28.32 24.16,27.03 32.11,27.03 v32.11,27.43
  Bottom 0.254: v32.11,15.44 v32.11,27.43
EXT_CLOCK_IN
  Top 0.254: IC3.32 40.56,27.13 39.75,27.94 39.75,30.1 39.37,30.48 JP9.1
EXT_CLOCK_OUT
  Top 0.254: JP4.2 36.2,29.21 37.97,29.21 38.86,28.32 38.86,27.94 40.17,26.63 IC3.33
EXT_TRIGGER_IN  (via drill 0.51)
  Top 0.254: IC3.26 46.86,30.36 v45.97,30.99 | v42.93,32 36.45,32 JP4.1
  Bottom 0.254: v45.97,30.99 45.97,30.86 44.83,32 v42.93,32
FLASH_CS  (via drill 0.51)
  Top 0.254: IC3.24 49.11,33.19 47.75,34.54 47.75,38.61 v44.45,41.91 JP5.6 | IC1.4 24.79,29.6 24.79,28.45 25.4,27.84 30.48,27.84 31.09,28.45 v31.09,30.07 | IC2.1 36.2,40.26 v36.2,41.91
  Bottom 0.254: v31.09,30.07 31.09,40.64 32.36,41.91 v36.2,41.91 36.7,41.91 v44.45,41.91
FLASH_SCK  (via drill 0.51)
  Top 0.254: v47.24,31.62 47.12,31.75 46.99,31.75 44.83,33.91 44.83,37.34 44.45,37.72 IC2.6 41.66,37.72 41.27,38.1 41.27,42.29 41.91,42.93 JP5.5 | IC3.50 46.45,18.13 v45.72,17.4 45.59,17.27 41.4,17.27 40.64,16.51 30.1,16.51 25.38,21.23 IC1.26
  Bottom 0.254: v47.24,31.62 47.88,30.99 47.88,17.78 47.5,17.4 v45.72,17.4
FLASH_SI
  Top 0.254: IC1.2 26.01,29.68 26.01,30.68 26.62,31.29 32.92,31.29 34.14,32.51 38.05,32.51 40.26,34.72 40.26,36.45 | IC3.27 45.76,29.63 45.11,30.28 45.11,32.11 43.69,33.53 43.69,36.32 43.56,36.45 IC2.5 40.26,36.45 | 40.26,36.45 40.26,42.29 39.37,43.18 JP5.4
FLASH_SO  (via drill 0.51)
  Top 0.254: IC1.3 25.4,29.69 25.4,31.5 25.81,31.9 32.31,31.9 33.86,33.45 v36.58,33.45 36.63,33.45 39.37,36.2 39.37,38.99 | v37.8,20.73 45.31,20.73 45.72,21.13 IC3.44 | JP5.3 36.83,44.45 39.37,41.91 39.37,38.99 | 39.37,38.99 IC2.2
  Bottom 0.254: v37.8,20.73 38.61,20.73 38.81,20.93 38.81,32.84 38.2,33.45 v36.58,33.45
FPGA_AUX0
  Top 0.254: IC3.40 46.84,23.11 46.23,23.11 45.36,23.98 25.5,23.98 24.77,23.24 24.77,22.39 IC1.25
FPGA_AUX1
  Top 0.254: IC3.36 46.84,25.15 24.77,25.15 23.43,23.81 IC1.23
FPGA_AUX2
  Top 0.254: IC1.22 22.76,22.35 22.76,23.98 24.41,25.63 IC3.35
FPGA_AUX3
  Top 0.254: JP9.2 39.27,26.13 IC3.34
FPGA_CS
  Top 0.254: IC3.38 46.13,24.18 45.72,24.59 25.4,24.59 24.08,23.27 IC1.24
GND  (via drill 0.51)
  Top 0.254: IC3.52 49.11,17.68 v49.07,17.65 | IC3.59 52.61,17.68 53.24,18.31 v53.24,19.1 | IC3.64 55.11,17.68 54.66,18.13 v54.66,19.1 | IC3.72 59.11,17.68 v58.67,17.68 | IC3.93 60.86,26.63 v60.96,26.21 60.96,23.63 IC3.87 | IC3.7 57.61,30.48 58.04,29.97 v58.04,28.85 | IC3.19 51.61,30.48 v52.35,29.74 | IC3.81 59.44,20.63 v59.44,20.19 | 48.26,24.63 IC3.37 | 48.26,24.63 50.09,24.63 v50.09,24.59 | v48.87,28.27 48.66,28.63 IC3.29 | IC3.42 48.26,22.13 48.26,23.63 | 48.26,23.63 IC3.39 | 48.26,23.63 48.26,24.63 | C17.2 v51.69,40.64 | C18.2 v53.72,40.64 | C26.2 v68.96,19.18 | C23.2 v67.82,21.08 | C22.2 64.64,12.19 v65.02,11.81 | C21.2 64.9,14.22 v65.02,14.35 | v45.47,11.18 C16.2 | v45.47,13.21 C15.2 | C13.2 v41.15,22.1 | C14.2 v41.15,19.3 40.23,18.39 Q2.2@2 | C11.2 v40.64,30.61 | IC3.99 61.43,29.63 61.01,29.21 v59.18,29.21 | v80.26,29.72 80.3,29.75 | IC3.14 54.11,30.41 v53.59,29.9 | C20.2 v59.18,40.64 | C24.2 68.07,30.1 v68.33,29.84 | C25.2 v68.45,28.4 | C9.2 79.61,30.37 v80.26,29.72 | C19.2 57.02,40.26 v57.4,40.64 | IC1.8 22.15,29.64 v22.15,27.03 | IC1.19 20.83,23.62 20.68,23.77 20.52,23.77 | C28.2 82.81,18.99 IC4.1 81.03,19.76 80.47,20.32 v80.47,21.18 80.47,21.23 80.49,21.26 IC4.4 | IC4.48 75.64,19.76 76.2,20.32 76.2,21.26 | 76.2,21.26 IC4.45 | 76.2,21.26 | v76.12,21.21 76.17,21.23 76.2,21.26 | IC4.21 80.3,29.76 v80.26,29.72 | IC4.10 80.49,24.26 v80.47,24.28 80.47,26.11 81.11,26.76 IC4.15 | IC4.34 75.35,26.76 76.05,26.06 v76.05,24.28 76.02,24.26 IC4.39 | IC4.28 76.09,29.76 76.1,29.77 | IC4.25 75.62,31.26 76.1,30.79 76.1,29.77 | 76.1,29.77 v76.05,29.77 | IC4.24 82.05,32.96 v82.04,32.97 | 20.75,3.73 20.8,3.73 21.77,4.7 v21.84,4.7 21.87,4.7
  Top 0.305: C10.2 33.01,37.21 | v35.18,34.67 32.51,34.67 32.51,35.81 v32.64,35.94
  Top 0.406: JP2.3 26.67,2.79 | C12.2 v40.89,28.45 | 32.38,14.48 v34.54,14.48 | v42.04,33.02 v42.04,35.05 | IC2.4 36.25,35.1 35.81,34.67 v35.18,34.67
  Top 0.813: v60.96,26.21 v59.18,26.21 | C12.2 C11.2
  Bottom 0.254: v59.18,40.64 60.2,40.64
  Bottom 0.406: 30.48,34.67 30.48,36.32 | 74.93,34.92 74.93,34.8 | v40.64,30.61 40.64,32.51 v42.04,33.02 | v42.04,35.05 39.62,35.81 40.64,36.83
  other vias: 11.3,21.59 11.43,20.07 11.43,18.54 8.76,17.22 18.29,38.61 25.65,38.61 16.99,30.91 9.78,38.48 18.41,46.1 6.1,45.97 19.81,14.86 24.26,16.26 6.93,11.28 2.67,17.27 12.19,5.08 8.89,4.7 15.37,4.57 18.29,5.08 26.92,6.1 27.3,14.48 28.45,41.66 20.12,24.13
  pour Bottom (isolate 0.305, rank 3): 1.27,46.99 91.44,46.99 91.44,1.27 1.27,1.27
  pour Top (isolate 0.406): 1.27,46.99 33.02,46.99 33.02,1.27 1.27,1.27
INIT_B
  Top 0.254: IC3.25 48.26,31.88 46.35,33.78 R6.1
INPUT17
  Top 0.254: IC3.83 63.79,21.63 64.14,21.97 68.58,21.97 70.29,20.26 IC4.47
INPUT18
  Top 0.254: IC3.84 63.53,22.13 63.88,22.48 68.83,22.48 70.56,20.76 IC4.46
INPUT19
  Top 0.254: IC3.85 63.27,22.63 63.63,22.99 69.09,22.99 70.32,21.76 IC4.44
INPUT20
  Top 0.254: IC3.86 63.01,23.13 63.37,23.5 69.34,23.5 70.58,22.26 IC4.43
INPUT21
  Top 0.254: IC3.88 70.51,24.13 71.38,23.26 IC4.41
INPUT22
  Top 0.254: IC3.89 70.82,24.63 71.69,23.76 IC4.40
INPUT23
  Top 0.254: IC3.90 71.22,25.13 71.59,24.76 IC4.38
INPUT24
  Top 0.254: IC3.91 71.4,25.63 71.77,25.26 IC4.37
INPUT25
  Top 0.254: IC3.5 58.61,33.47 59.69,34.55 59.69,34.54 68.33,34.54 72.11,30.76 IC4.26
INPUT26
  Top 0.254: IC3.4 59.11,33.2 59.94,34.04 67.94,34.04 71.72,30.26 IC4.27
INPUT27
  Top 0.254: IC3.3 59.61,32.81 60.33,33.53 67.56,33.53 71.83,29.26 IC4.29
INPUT28
  Top 0.254: IC3.2 60.11,32.55 60.58,33.02 67.31,33.02 71.57,28.76 IC4.30
INPUT29
  Top 0.254: IC3.98 63.17,29.13 63.5,29.46 63.5,30.48 64.26,31.24 68.33,31.24 71.81,27.76 IC4.32
INPUT30
  Top 0.254: IC3.95 63.3,27.63 63.67,27.26 IC4.33
INPUT31
  Top 0.254: IC3.94 63.04,27.13 63.5,26.67 71.88,26.67 72.29,26.26 IC4.35
INPUT32
  Top 0.254: IC3.92 71.66,26.13 72.03,25.76 IC4.36
LED1
  Top 0.254: R7.2 4.91,39.22 7.72,39.22 8.74,38.2 8.74,33.33 9.96,32.11 18.29,32.11 18.88,31.52 IC1.13
MCLR  (via drill 0.51)
  Top 0.254: R3.1 12.06,41.4 | 7.62,44.45 v20.32,44.45 | v28.04,29.67 IC1.1
  Top 0.305: R3.1 11.85,41.53 10.16,41.53 9.78,41.91 S1.1 6.35,41.91 | 7.62,44.45 6.35,43.18 6.35,41.91 | S1.2 4.95,41.91 v5.33,41.53 5.71,41.91 6.35,41.91
  Bottom 0.254: v20.32,44.45 22.91,41.86 26.42,41.86 26.68,41.6 IC1.1 v28.04,29.67
  Bottom 0.305: JP2.1 30.48,1.27 2.54,1.27 1.27,2.54 1.27,41.53 v5.33,41.53
N$1
  Top 0.254: 21.59,34.29 21.48,34.18 IC1.9 | C5.1 21.91,34.81 22.01,34.71
  Top 0.305: Q1.2 22.23,35.56 21.59,35.56 21.59,34.29 22.01,34.71
N$2
  Top 0.254: 13.42,34.89 13.56,34.75 17.88,34.75 20.83,31.8 IC1.10 | C6.1 13.52,34.99 Q1.1
  Top 0.305: Q1.1 13.42,34.89
N$3  (via drill 0.51)
  Top 0.254: v19.43,28.07 19.53,28.07 IC1.12
  Top 0.305: R4.2 24.13,41.56 23.2,41.56 22.86,41.91 S2.4 18.16,41.91 v17.78,41.53 17.4,41.91 S2.3
  Bottom 0.254: 17.78,28.07 v19.43,28.07
  Bottom 0.305: v17.78,41.53 9.32,41.53 8.41,40.62 8.41,30.99 9.55,29.84 16,29.84 17.78,28.07
N$4
  Top 0.254: C4.+ arc90 28.45,36.47 28.45,34.14 27.43,33.12 23.98,33.12 23.43,32.57 IC1.6
N$5
  Top 0.305: PWR.A 2.76,31.85 R2.1
N$6
  Top 0.406: R9.1 ARMED.A
N$7
  Top 0.305: ACT.A 2.76,39.27 R7.1
N$8
  Top 0.406: R8.1 TRIGGER.A
N$11
  Top 0.254: IC4.12 87.77,25.26 JP8.9
N$12
  Top 0.254: IC4.11 85.73,24.76 JP8.8
N$13
  Top 0.254: IC4.9 84.19,23.76 JP8.7
N$14
  Top 0.254: JP8.6 88.9,16.51 88.9,17.78 83.42,23.26 IC4.8
N$15
  Top 0.254: JP8.5 87.88,14.99 87.88,17.78 83.41,22.26 IC4.6
N$16
  Top 0.254: JP8.4 86.87,13.46 86.87,18.03 83.14,21.76 IC4.5
N$17
  Top 0.254: JP8.3 87.5,7.62 86.11,9.02 86.11,17.91 83.25,20.76 IC4.3
N$18
  Top 0.254: JP8.2 86.61,5.08 85.22,6.48 85.22,17.96 82.92,20.26 IC4.2
N$19
  Top 0.254: IC4.13 89.81,25.76 JP7.1
N$20
  Top 0.254: 89.75,27.52 JP7.2 88.49,26.26 IC4.14
N$22
  Top 0.254: IC4.16 86.95,27.26 JP7.3
N$23
  Top 0.254: IC4.17 84.91,27.76 JP7.4
N$24
  Top 0.254: IC4.19 83.37,28.76 JP7.5
N$25
  Top 0.254: JP7.6 84.33,32.26 84.33,30.68 82.9,29.26 IC4.20
N$26
  Top 0.254: JP7.7 83.31,33.78 83.31,30.68 82.89,30.26 IC4.22
N$27
  Top 0.254: JP7.8 89.15,43.18 80.77,34.8 80.77,30.99 81,30.76 IC4.23
OSC_IN
  Top 0.254: IC3.41 45.95,22.63 45.21,23.37 40.17,23.37 Q2.3@3
PGC  (via drill 0.51)
  Top 0.254: IC1.27 26.01,22.34 26.01,21.34 29.57,17.78 v30.28,17.78
  Bottom 0.305: v30.28,17.78 30.28,7.62 27.94,5.08 24.13,5.08 JP2.5
PGD  (via drill 0.51)
  Top 0.254: IC1.28 26.62,22.29 26.62,21.54 28.04,20.12 v31.09,20.12
  Bottom 0.254: JP2.4 24.13,3.4 25.2,4.47 28.25,4.47 31.09,7.52 31.09,16.46 31.5,16.87 31.5,19.71 v31.09,20.12
PROG_B  (via drill 0.51)
  Top 0.254: R5.1 v49.53,43.18 49.66,43.05 v54.1,43.05 | IC3.1 60.61,30.89 v60.2,30.48 | IC1.5 24.13,29.72 24.13,32.13 24.51,32.51 28.85,32.51 30.28,33.93 30.28,42.47 29.21,43.54 JP3.2
  Bottom 0.254: JP3.2 29.21,46.35 29.84,46.99 49.53,46.99 v49.53,43.18 | v60.2,30.48 57.15,30.48 54.61,33.02 54.61,42.55 v54.1,43.05
RC4
  Top 0.254: IC1.15 18.23,21.07 17.88,20.73 14.48,20.73 14.22,20.98 14.22,24.38 13.72,24.89 9.45,24.89 9.35,24.99 8.78,24.99 J1.2
RC5
  Top 0.254: J1.3 13.08,24.13 13.46,23.75 13.46,20.57 13.97,20.07 18.44,20.07 18.88,20.5 IC1.16
RX1
  Top 0.254: JP1.3 2.64,12.8 3.91,12.8 5.08,13.97 10.57,13.97 14.07,17.48 18.69,17.48 20.18,18.96 IC1.18
TCK
  Top 0.254: IC3.77 62.9,18.63 63.12,18.41 63.12,17.27 63.63,16.76 70.36,16.76 JP6.3
TDI  (via drill 0.51)
  Top 0.254: v62.36,31.62 IC3.100
  Bottom 0.254: JP6.5 71.88,10.16 71.88,6.86 73.66,5.08 80.01,5.08 83.82,8.89 83.82,16.51 78.74,21.59 78.74,27.81 78.23,28.32 72.01,28.32 68.71,31.62 v62.36,31.62
TDO
  Top 0.254: IC3.76 62.36,16.89 63.12,16.13 68.45,16.13 JP6.4
TMS
  Top 0.254: 60.61,16.51 IC3.75 61.73,16.38 62.61,15.49 65.79,15.49 66.29,14.99 JP6.6
TRIGGER_OUT  (via drill 0.51)
  Top 0.254: TRIGGER.C 73.06,45.5 72.39,44.83 v72.39,43.94 | IC3.10 56.11,33.68 v55.63,34.16
  Bottom 0.254: v72.39,43.94 71.63,43.18 57.15,43.18 55.24,41.27 55.24,34.54 v55.63,34.16
TX1
  Top 0.254: JP1.4 10.57,15.24 13.61,18.29 18.29,18.29 19.53,19.53 IC1.17
VUSB  (via drill 0.51, 0.76, 1.02)
  Top 0.305: 4.95,31.68 R2.2 4.76,31.7 v6.35,31.7
  Top 0.406: VR2.1 14.29,7.3 14.61,7.62 15.75,7.62 16.13,7.24 16.13,6.38 VR2.3 | VR3.3 22.48,6.38 22.48,7.24 22.1,7.62 20.83,7.62 20.57,7.37 20.57,6.39 VR3.1 20.54,6.32 | WING1.5V@5 63.5,2.54 53.34,2.54 50.8,5.08 45.72,5.08 WING1.5V@4 43.18,2.54 36.83,2.54 30.99,8.26 v27.56,8.26 | 7.84,6.32 VR1.1 7.94,7.43 8.13,7.62 9.53,7.62 9.78,7.37 9.78,6.38 VR1.3
  Top 0.61: v13.97,2.67 13.97,6 VR2.1 | 20.54,6.32 20.19,5.97 v20.19,4.83 | v5.08,3.43 5.84,4.19 C27.+ 7.74,6.12 VR1.1
  Top 0.813: L1.2 15.7,22.81 v15.9,22.61
  Bottom 0.305: v6.35,31.7 5.03,31.7 3.81,30.48 3.81,28.04
  Bottom 0.61: v27.56,8.26 22.1,8.26 20.32,6.35 20.32,5.33 v20.19,4.83
  Bottom 0.813: v5.08,3.43 5.74,2.67 v13.97,2.67 18.03,2.67 v20.19,4.83 | 5.08,7.62 JP1.1
  Bottom 1.016: v5.08,3.43 5.08,7.62
  Bottom 1.27: 5.08,7.62 5.08,19.05 3.81,20.32 3.81,28.04 7.62,28.04 8.81,26.67 13.97,26.67 15.9,24.74 v15.9,22.61
WINGA1
  Top 0.254: IC3.53 49.61,15.83 49.28,15.49 43.43,15.49 37.59,9.65 WING1.A1@1
WINGA2
  Top 0.254: IC3.54 50.11,15.31 49.53,14.73 45.21,14.73 40.13,9.65 WING1.A2@1
WINGA3
  Top 0.254: IC3.57 51.61,11.73 49.78,9.91 43.43,9.91 42.67,9.14 WING1.A3@1
WINGA4
  Top 0.254: IC3.58 52.11,11.22 50.29,9.4 45.97,9.4 45.21,8.64 WING1.A4@1
WINGA5
  Top 0.254: IC3.60 53.11,11.2 50.29,8.38 48.01,8.38 47.75,8.13 WING1.A5@1
WINGA6
  Top 0.254: IC3.61 53.61,10.43 WING1.A6@1
WINGA7
  Top 0.254: IC3.62 54.11,9.41 52.83,8.13 WING1.A7@1
WINGA8
  Top 0.254: IC3.63 54.61,15.24 54.86,14.99 54.86,7.62 WING1.A8@1
WINGA9
  Top 0.254: IC3.65 55.61,9.41 WING1.A9@1
WINGA10
  Top 0.254: IC3.66 56.11,10.95 59.44,7.62 59.94,7.62 WING1.A10@1
WINGA11
  Top 0.254: IC3.67 56.61,11.46 59.44,8.64 62.74,8.64 62.99,8.38 WING1.A11@1
WINGA12
  Top 0.254: IC3.68 57.11,11.98 59.94,9.14 65.02,9.14 65.53,8.64 WING1.A12@1
WINGA13
  Top 0.254: IC3.70 58.11,12.25 60.45,9.91 67.31,9.91 68.07,9.14 WING1.A13@1
WINGA14
  Top 0.254: IC3.71 58.61,12.76 60.71,10.67 68.07,10.67 70.61,8.13 WING1.A14@1
WINGA15
  Top 0.254: IC3.78 63.29,19.13 63.63,18.8 63.63,18.29 64.52,17.4 77.85,17.4 81.28,13.97 81.28,11.43 78.74,8.89 74.93,8.89 WING1.A15@1
WINGA16
  Top 0.254: WING1.A16@1 76.96,5.84 79.12,5.84 82.55,9.27 82.55,13.97 78.49,18.03 64.64,18.03 64.14,18.54 64.14,19.43 63.94,19.63 IC3.79

### Text on the board
tPlace: RESET | UPDATE | TRIG | ARM | Open Bench | PGM-EN | 3V3 | GND | SO | SI | SCK | CS | Logic Sniffer v1.04 | GND | GND | ROM-ISP | www.GadgetFactory.net | 15 | 31 | www.DangerousPrototypes.com | Current license: CC-BY-SA-NC | RESET | UPDATE | 14 | 30 | ACT | Copyright 2009 | Copyright 2009-2010 | 13 | 29 | Ian Lesnet | PWR | Jack Gassett | 12 | 28 | TRGI | CKI | 11 | 27 | 10 | 26 | 9 | 25 | CKO | TRGO | 12/15/2009 | 8 | 24 | 7 | 23 | 6 | 22 | 5 | JTAG | 21 | TX | 20 | 21 | TMS | TDI | TDO | TCK | GND | 2V5 | 4 | 20 | UART | Built for SUMP | Fulfillment by | RX | www.sump.org | Seeed Studio | GND | Michael Poppitz | www.SeeedStudio.com | 3 | 19 | GPL 2007 | V+ | GND | 16 | 17 | 18 | 19 | 22 | 23 | 24 | 25 | 26 | 27 | 28 | 29 | 30 | 31 | GND | 2 | 18 | GND | 0 | 1 | 2 | 3 | 4 | 5 | 6 | 7 | 8 | 9 | 10 | 11 | 12 | 13 | 14 | 15 | GND | 1 | 17 | ICSP | 0 | PGC | PGD | GND | 3V3 | VPP | 16 | GND | 2V5 | 3V3 | 5V | GND | 2V5 | 3V3 | 5V | GND | GND